# Altium schematic sheet PLD_I2C_Switch.SchDoc: I2C Switch
size A4; ApprovedBy: Piotr Kuligowski; CheckedBy: Piotr Kuligowski; Author: Michał Gumiela; SheetNumber: 7; SheetTotal: 13
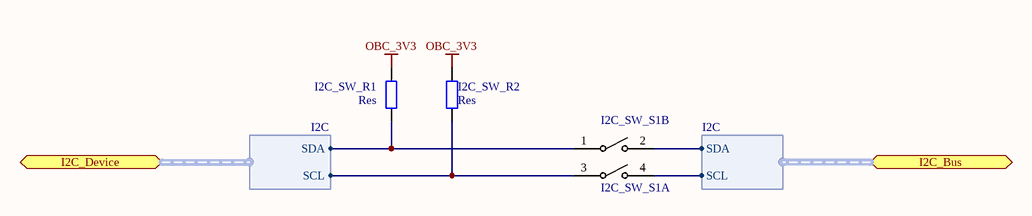
[diagram p0: PLD_I2C_Switch.SchDoc]

## Parts
I2C_SW_R1  Res  [SMD_Resistor_0603]
I2C_SW_R2  Res  [SMD_Resistor_0603]
I2C_SW_S1  MCEPM-02  [MCEPM-02]  (value not drawn)  (parts A,B of 2)

## Ports
I2C_Bus (harness I2C), I2C_Device (harness I2C)

## Harnesses
I2C: SDA, SCL

## Nets
OBC_3V3: I2C_SW_R1.1 I2C_SW_R2.1
NetI2C_SW_R1_2: I2C_SW_R1.2 I2C_SW_S1.1 ; port I2C_Device.SDA
NetI2C_SW_R2_2: I2C_SW_R2.2 I2C_SW_S1.3 ; port I2C_Device.SCL
NetI2C_SW_S1_2: I2C_SW_S1.2 ; port I2C_Bus.SDA
NetI2C_SW_S1_4: I2C_SW_S1.4 ; port I2C_Bus.SCL

## Notes on the sheet
- Title:
- Project:
- Author:
- Model:
- Document Number:
- Checked by:
- Rev:
- Date:
- Approved by:
- Sheet:
- of
- File name:

## Library data of the parts
I2C_SW_R1 I2C_SW_R2 = Res: Value: Res; Package: 0603
I2C_SW_S1 = MCEPM-02: Supplier 1: Farnell